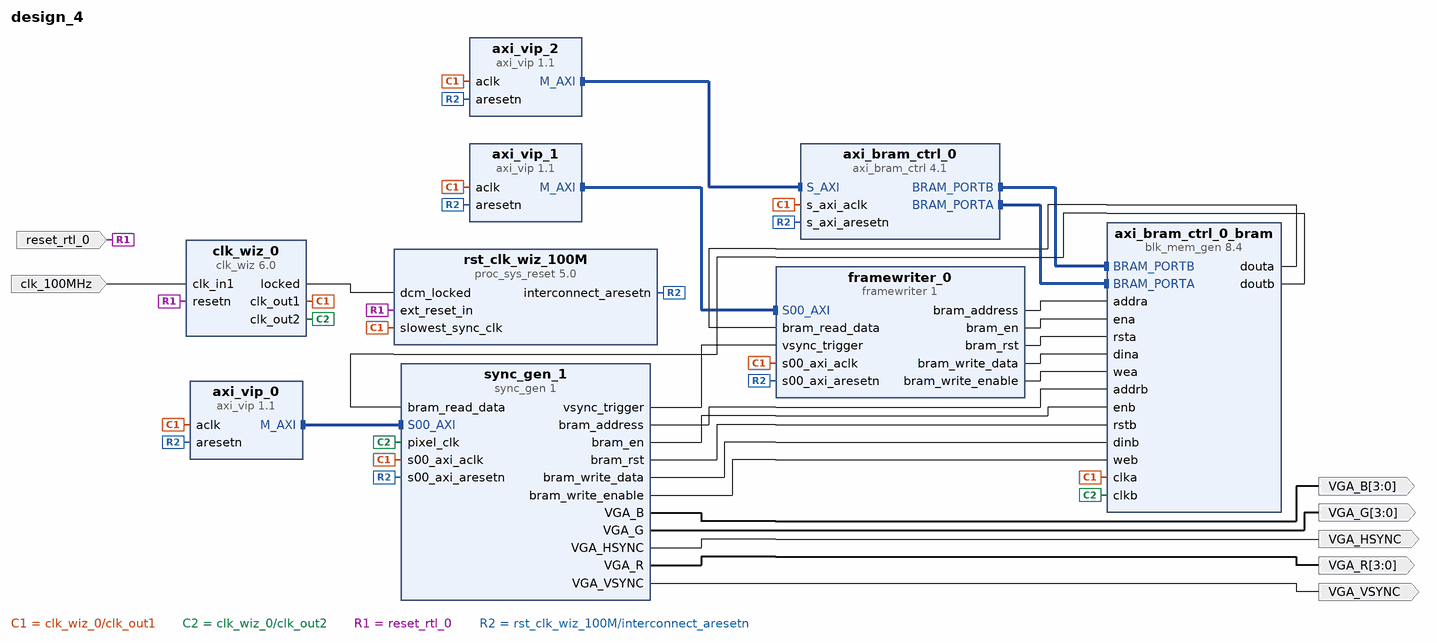
[diagram p0: block diagram of the top level]
# Vivado block design design_4, xc7a100tcsg324-1, Vivado 2018.3
create_bd_design design_4

create_bd_port -dir O -from 3 -to 0 VGA_B
create_bd_port -dir O -from 3 -to 0 VGA_G
create_bd_port -dir O VGA_HSYNC
create_bd_port -dir O -from 3 -to 0 VGA_R
create_bd_port -dir O VGA_VSYNC
create_bd_port -dir I -type clk clk_100MHz
set_property -dict {CONFIG.FREQ_HZ 100000000} [get_bd_ports clk_100MHz]
create_bd_port -dir I -type rst reset_rtl_0
set_property -dict {CONFIG.POLARITY ACTIVE_LOW} [get_bd_ports reset_rtl_0]

create_bd_cell -type ip -vlnv xilinx.com:ip:axi_bram_ctrl:4.1 axi_bram_ctrl_0
set_property -dict {CONFIG.PROTOCOL AXI4} [get_bd_cells axi_bram_ctrl_0]
create_bd_cell -type ip -vlnv xilinx.com:ip:blk_mem_gen:8.4 axi_bram_ctrl_0_bram
set_property -dict [list \
  CONFIG.EN_SAFETY_CKT true \
  CONFIG.Enable_32bit_Address true \
  CONFIG.Enable_B Use_ENB_Pin \
  CONFIG.Memory_Type True_Dual_Port_RAM \
  CONFIG.Operating_Mode_B WRITE_FIRST \
  CONFIG.Port_B_Clock 100 \
  CONFIG.Port_B_Enable_Rate 100 \
  CONFIG.Port_B_Write_Rate 50 \
  CONFIG.Register_PortA_Output_of_Memory_Primitives false \
  CONFIG.Register_PortB_Output_of_Memory_Primitives false \
  CONFIG.Use_RSTA_Pin true \
  CONFIG.Use_RSTB_Pin true \
  CONFIG.use_bram_block BRAM_Controller \
] [get_bd_cells axi_bram_ctrl_0_bram]
create_bd_cell -type ip -vlnv xilinx.com:ip:axi_vip:1.1 axi_vip_0
set_property -dict [list \
  CONFIG.ADDR_WIDTH 32 \
  CONFIG.DATA_WIDTH 32 \
  CONFIG.HAS_BRESP 1 \
  CONFIG.HAS_PROT 1 \
  CONFIG.HAS_RRESP 1 \
  CONFIG.HAS_WSTRB 1 \
  CONFIG.INTERFACE_MODE MASTER \
  CONFIG.PROTOCOL AXI4LITE \
  CONFIG.READ_WRITE_MODE READ_WRITE \
] [get_bd_cells axi_vip_0]
create_bd_cell -type ip -vlnv xilinx.com:ip:proc_sys_reset:5.0 rst_clk_wiz_100M
create_bd_cell -type ip -vlnv xilinx.com:ip:axi_vip:1.1 axi_vip_1
set_property -dict [list \
  CONFIG.ADDR_WIDTH 32 \
  CONFIG.DATA_WIDTH 32 \
  CONFIG.HAS_BRESP 1 \
  CONFIG.HAS_PROT 1 \
  CONFIG.HAS_RRESP 1 \
  CONFIG.HAS_WSTRB 1 \
  CONFIG.INTERFACE_MODE MASTER \
  CONFIG.PROTOCOL AXI4LITE \
  CONFIG.READ_WRITE_MODE READ_WRITE \
] [get_bd_cells axi_vip_1]
create_bd_cell -type ip -vlnv xilinx.com:ip:clk_wiz:6.0 clk_wiz_0
set_property -dict [list \
  CONFIG.CLKOUT1_DRIVES BUFG \
  CONFIG.CLKOUT1_JITTER 137.681 \
  CONFIG.CLKOUT1_PHASE_ERROR 105.461 \
  CONFIG.CLKOUT2_DRIVES BUFG \
  CONFIG.CLKOUT2_JITTER 183.467 \
  CONFIG.CLKOUT2_PHASE_ERROR 105.461 \
  CONFIG.CLKOUT2_REQUESTED_OUT_FREQ 25.175 \
  CONFIG.CLKOUT2_USED true \
  CONFIG.CLKOUT3_DRIVES BUFG \
  CONFIG.CLKOUT4_DRIVES BUFG \
  CONFIG.CLKOUT5_DRIVES BUFG \
  CONFIG.CLKOUT6_DRIVES BUFG \
  CONFIG.CLKOUT7_DRIVES BUFG \
  CONFIG.MMCM_CLKFBOUT_MULT_F 9 \
  CONFIG.MMCM_CLKOUT0_DIVIDE_F 9 \
  CONFIG.MMCM_CLKOUT1_DIVIDE 36 \
  CONFIG.MMCM_COMPENSATION ZHOLD \
  CONFIG.MMCM_DIVCLK_DIVIDE 1 \
  CONFIG.NUM_OUT_CLKS 2 \
  CONFIG.PRIMITIVE PLL \
  CONFIG.RESET_PORT resetn \
  CONFIG.RESET_TYPE ACTIVE_LOW \
] [get_bd_cells clk_wiz_0]
create_bd_cell -type ip -vlnv xilinx.com:ip:axi_vip:1.1 axi_vip_2
set_property -dict [list \
  CONFIG.ADDR_WIDTH 32 \
  CONFIG.ARUSER_WIDTH 0 \
  CONFIG.AWUSER_WIDTH 0 \
  CONFIG.BUSER_WIDTH 0 \
  CONFIG.DATA_WIDTH 32 \
  CONFIG.HAS_BRESP 1 \
  CONFIG.HAS_BURST 1 \
  CONFIG.HAS_CACHE 1 \
  CONFIG.HAS_LOCK 1 \
  CONFIG.HAS_PROT 1 \
  CONFIG.HAS_QOS 1 \
  CONFIG.HAS_REGION 1 \
  CONFIG.HAS_RRESP 1 \
  CONFIG.HAS_WSTRB 1 \
  CONFIG.ID_WIDTH 0 \
  CONFIG.INTERFACE_MODE MASTER \
  CONFIG.PROTOCOL AXI4 \
  CONFIG.READ_WRITE_MODE READ_WRITE \
  CONFIG.RUSER_BITS_PER_BYTE 0 \
  CONFIG.RUSER_WIDTH 0 \
  CONFIG.SUPPORTS_NARROW 1 \
  CONFIG.WUSER_BITS_PER_BYTE 0 \
  CONFIG.WUSER_WIDTH 0 \
] [get_bd_cells axi_vip_2]
create_bd_cell -type ip -vlnv xilinx.com:user:sync_gen:1 sync_gen_1
create_bd_cell -type ip -vlnv xilinx.com:user:framewriter:1 framewriter_0

# ---- connections ----

connect_bd_intf_net [get_bd_intf_pins axi_bram_ctrl_0/BRAM_PORTB] [get_bd_intf_pins axi_bram_ctrl_0_bram/BRAM_PORTB]
connect_bd_intf_net [get_bd_intf_pins axi_vip_0/M_AXI] [get_bd_intf_pins sync_gen_1/S00_AXI]
connect_bd_intf_net [get_bd_intf_pins axi_vip_2/M_AXI] [get_bd_intf_pins axi_bram_ctrl_0/S_AXI]
connect_bd_intf_net [get_bd_intf_pins axi_vip_1/M_AXI] [get_bd_intf_pins framewriter_0/S00_AXI]
connect_bd_intf_net [get_bd_intf_pins axi_bram_ctrl_0/BRAM_PORTA] [get_bd_intf_pins axi_bram_ctrl_0_bram/BRAM_PORTA]
connect_bd_net [get_bd_pins axi_bram_ctrl_0_bram/douta] [get_bd_pins framewriter_0/bram_read_data]
connect_bd_net [get_bd_pins axi_bram_ctrl_0_bram/doutb] [get_bd_pins sync_gen_1/bram_read_data]
connect_bd_net [get_bd_ports clk_100MHz] [get_bd_pins clk_wiz_0/clk_in1]
connect_bd_net -net clk_100MHz_clk_out1 [get_bd_pins clk_wiz_0/clk_out1] \
  [get_bd_pins axi_vip_0/aclk] [get_bd_pins rst_clk_wiz_100M/slowest_sync_clk] [get_bd_pins axi_bram_ctrl_0/s_axi_aclk] \
  [get_bd_pins axi_bram_ctrl_0_bram/clka] [get_bd_pins axi_vip_1/aclk] [get_bd_pins axi_vip_2/aclk] \
  [get_bd_pins sync_gen_1/s00_axi_aclk] [get_bd_pins framewriter_0/s00_axi_aclk]
connect_bd_net -net clk_100MHz_clk_out2 [get_bd_pins clk_wiz_0/clk_out2] [get_bd_pins axi_bram_ctrl_0_bram/clkb] [get_bd_pins sync_gen_1/pixel_clk]
connect_bd_net [get_bd_pins framewriter_0/bram_address] [get_bd_pins axi_bram_ctrl_0_bram/addra]
connect_bd_net [get_bd_pins framewriter_0/bram_en] [get_bd_pins axi_bram_ctrl_0_bram/ena]
connect_bd_net [get_bd_pins framewriter_0/bram_rst] [get_bd_pins axi_bram_ctrl_0_bram/rsta]
connect_bd_net [get_bd_pins framewriter_0/bram_write_data] [get_bd_pins axi_bram_ctrl_0_bram/dina]
connect_bd_net [get_bd_pins framewriter_0/bram_write_enable] [get_bd_pins axi_bram_ctrl_0_bram/wea]
connect_bd_net -net reset_rtl_0_1 [get_bd_ports reset_rtl_0] [get_bd_pins rst_clk_wiz_100M/ext_reset_in] [get_bd_pins clk_wiz_0/resetn]
connect_bd_net [get_bd_pins rst_clk_wiz_100M/interconnect_aresetn] \
  [get_bd_pins axi_vip_0/aresetn] [get_bd_pins axi_bram_ctrl_0/s_axi_aresetn] [get_bd_pins axi_vip_1/aresetn] \
  [get_bd_pins axi_vip_2/aresetn] [get_bd_pins sync_gen_1/s00_axi_aresetn] [get_bd_pins framewriter_0/s00_axi_aresetn]
connect_bd_net [get_bd_pins sync_gen_1/VGA_B] [get_bd_ports VGA_B]
connect_bd_net [get_bd_pins sync_gen_1/VGA_G] [get_bd_ports VGA_G]
connect_bd_net [get_bd_pins sync_gen_1/VGA_HSYNC] [get_bd_ports VGA_HSYNC]
connect_bd_net [get_bd_pins sync_gen_1/VGA_R] [get_bd_ports VGA_R]
connect_bd_net [get_bd_pins sync_gen_1/VGA_VSYNC] [get_bd_ports VGA_VSYNC]
connect_bd_net [get_bd_pins sync_gen_1/bram_address] [get_bd_pins axi_bram_ctrl_0_bram/addrb]
connect_bd_net [get_bd_pins sync_gen_1/bram_en] [get_bd_pins axi_bram_ctrl_0_bram/enb]
connect_bd_net [get_bd_pins sync_gen_1/bram_rst] [get_bd_pins axi_bram_ctrl_0_bram/rstb]
connect_bd_net [get_bd_pins sync_gen_1/bram_write_data] [get_bd_pins axi_bram_ctrl_0_bram/dinb]
connect_bd_net [get_bd_pins sync_gen_1/bram_write_enable] [get_bd_pins axi_bram_ctrl_0_bram/web]
connect_bd_net [get_bd_pins clk_wiz_0/locked] [get_bd_pins rst_clk_wiz_100M/dcm_locked]
connect_bd_net [get_bd_pins sync_gen_1/vsync_trigger] [get_bd_pins framewriter_0/vsync_trigger]

# ---- address map ----
assign_bd_address -offset 0x44A00000 -range 64K -target_address_space [get_bd_addr_spaces axi_vip_0/Master_AXI] [get_bd_addr_segs sync_gen_1/S00_AXI/S00_AXI_reg]
assign_bd_address -offset 0x10000000 -range 64K -target_address_space [get_bd_addr_spaces axi_vip_1/Master_AXI] [get_bd_addr_segs framewriter_0/S00_AXI/S00_AXI_reg]
assign_bd_address -offset 0xC0000000 -range 512K -target_address_space [get_bd_addr_spaces axi_vip_2/Master_AXI] [get_bd_addr_segs axi_bram_ctrl_0/S_AXI/Mem0]

validate_bd_design
save_bd_design
